# Altium schematic sheet DEBUG.SchDoc
size A3; DocumentNumber: 17; SheetNumber: 17; SheetTotal: 17
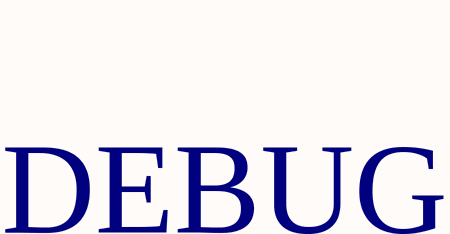
[diagram p0: DEBUG.SchDoc]

## Notes on the sheet
- DEBUG